# EAGLE design Qwiic-Step (EAGLE 9.5.2)
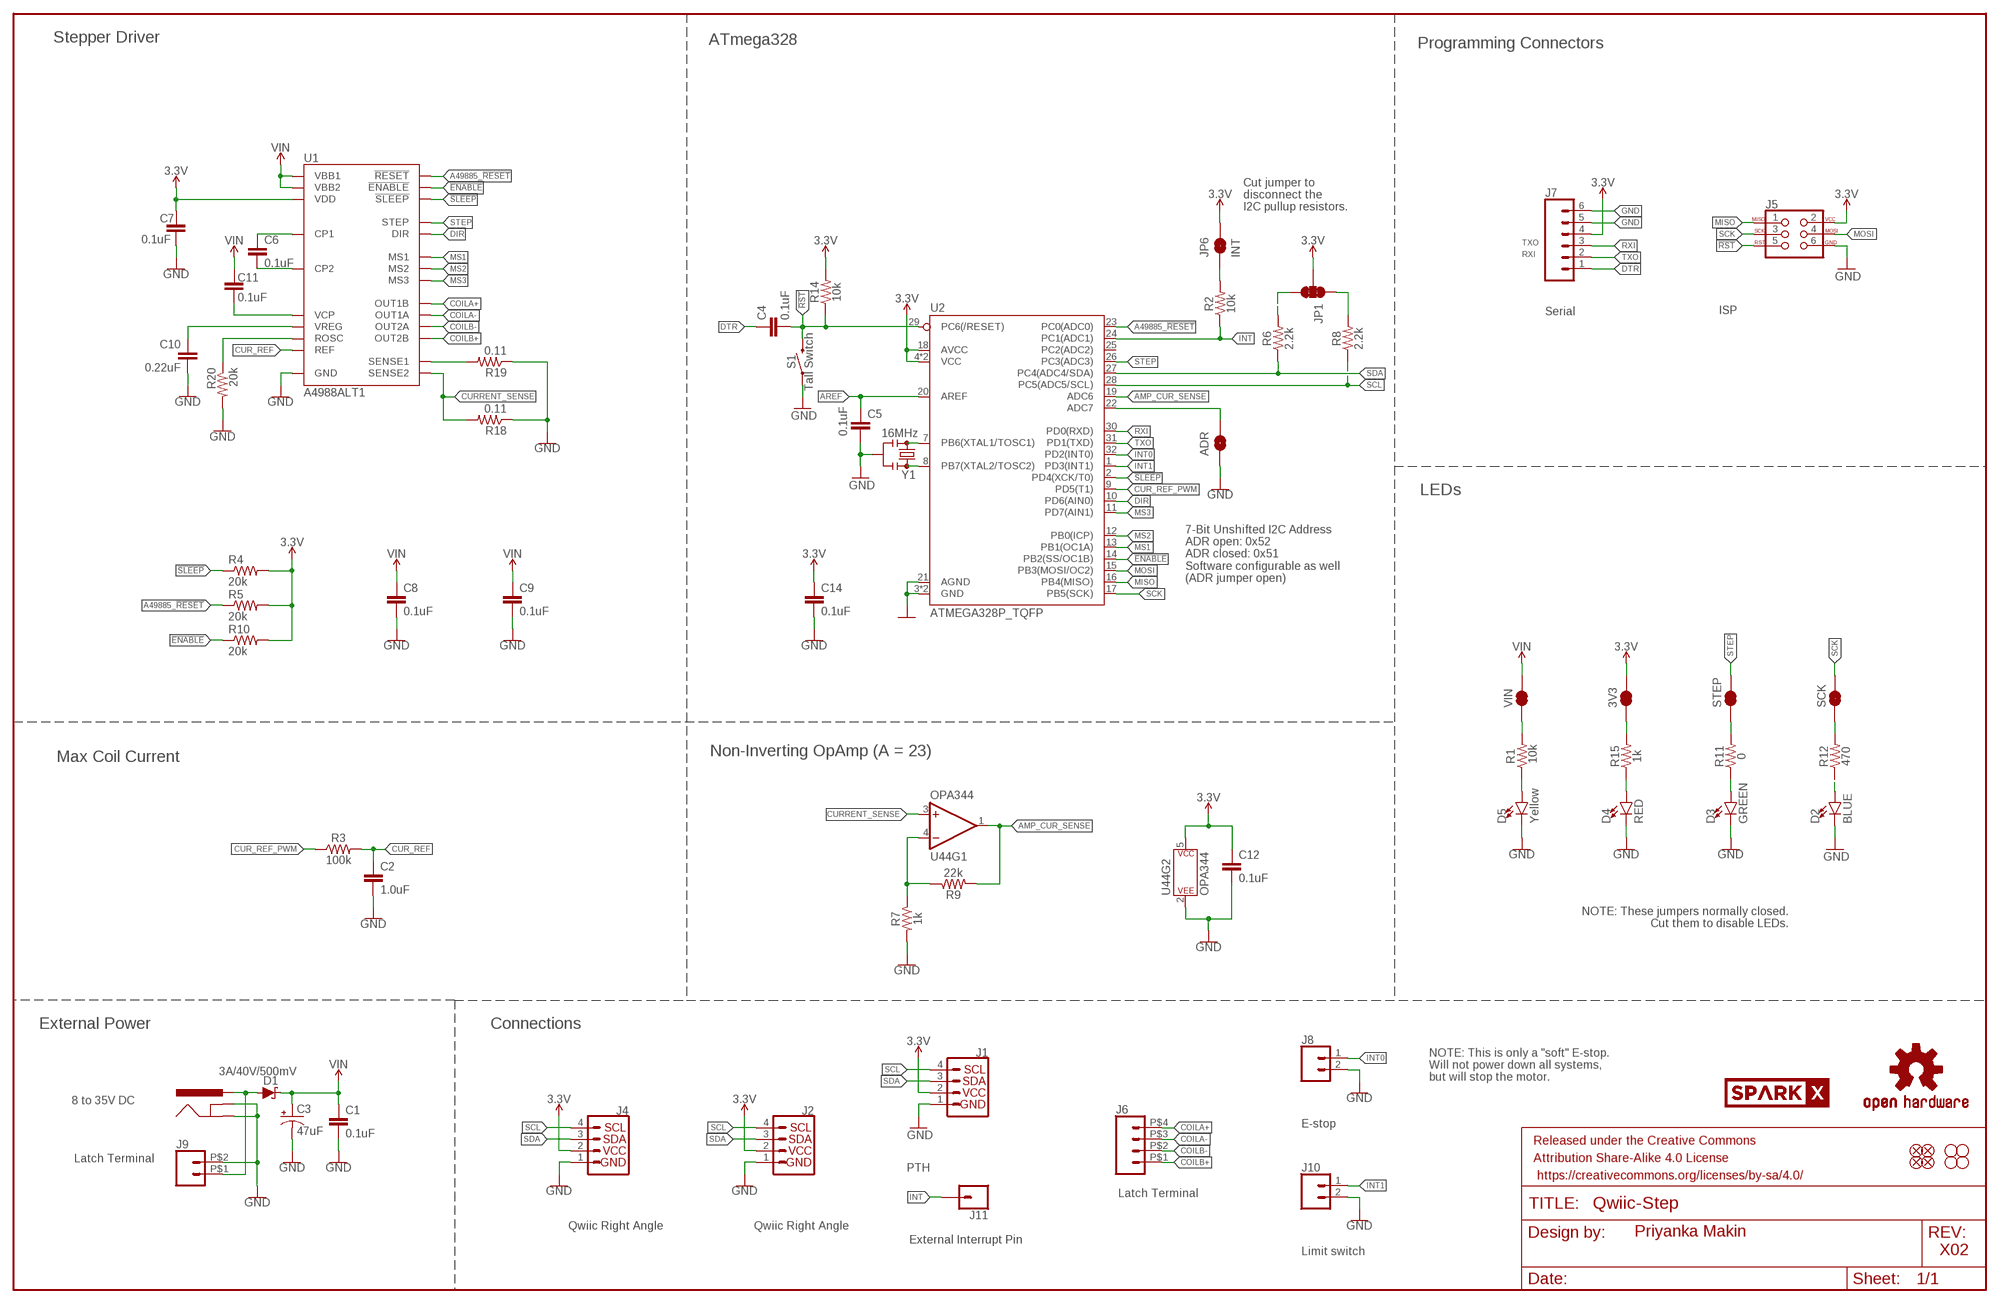
[diagram p0: schematic, sheet 1]

## Parts
3V3  JUMPER-SMT_2_NC_TRACE_SILK  [SMT-JUMPER_2_NC_TRACE_SILK]
ADR  ADR  JUMPER-SMT_2_NO_SILK  [SMT-JUMPER_2_NO_SILK]
C1  0.1uF  0.1UF-0603-100V-10%  [0603]
C2  1.0uF  1.0UF-0603-16V-10%-X7R  [0603]
C3  47uF  47UF-POLAR-PANASONIC_D-35V-20%  [PANASONIC_D]
C4  0.1uF  0.1UF-0603-100V-10%  [0603]
C5  0.1uF  0.1UF-0603-25V-(+80/-20%)  [0603]
C6  0.1uF  0.1UF-0603-100V-10%  [0603]
C7  0.1uF  0.1UF-0603-25V-(+80/-20%)  [0603]
C8  0.1uF  0.1UF-0603-100V-10%  [0603]
C9  0.1uF  0.1UF-0603-100V-10%  [0603]
C10  0.22uF  0.22UF-0603-50V-(-20/+80%)  [0603]
C11  0.1uF  0.1UF-0603-100V-10%  [0603]
C12  0.1uF  0.1UF-0603-25V-(+80/-20%)  [0603]
C14  0.1uF  0.1UF-0603-25V-(+80/-20%)  [0603]
D1  3A/40V/500mV  DIODE-SCHOTTKY-B340A  [SMA-DIODE]
D2  BLUE  LED-BLUE0603  [LED-0603]
D3  GREEN  LED-GREEN0603  [LED-0603]
D4  RED  LED-RED0603  [LED-0603]
D5  Yellow  LED-YELLOW0603  [LED-0603]
FD1  FIDUCIAL1X2  [FIDUCIAL-1X2]
FD2  FIDUCIAL1X2  [FIDUCIAL-1X2]
FD3  FIDUCIAL1X2  [FIDUCIAL-1X2]
FD4  FIDUCIAL1X2  [FIDUCIAL-1X2]
FRAME2  FRAME-LEDGER  [CREATIVE_COMMONS]
J1  PTH  I2C_STANDARD_NO_SILK  [1X04_NO_SILK]
J2  Qwiic Right Angle  I2C_STANDARDQWIIC  [JST04_1MM_RA]
J3  5.5x2.1mm Barrel  POWER_JACKSMD  [POWER_JACK_SMD]
J4  Qwiic Right Angle  I2C_STANDARDQWIIC  [JST04_1MM_RA]
J5  ISP  AVR_SPI_PROG_3X2TESTPOINTS  [2X3_TEST_POINTS]
J6  CONN_04LATCH  [LATCHTERMINAL-5MM-4]
J7  CONN_06NO_SILK_NO_POP  [1X06_NO_SILK]
J8  CONN_02-JST-2MM-SMT  [JST-2-SMD]
J9  CONN_02LATCH_2  [LATCHTERMINAL-5MM-2]
J10  CONN_02-JST-2MM-SMT  [JST-2-SMD]
J11  CONN_01PTH_NO_SILK_YES_STOP  [1X01_NO_SILK]
JP1  JUMPER-SMT_3_2-NC_TRACE_SILK  [SMT-JUMPER_3_2-NC_TRACE_SILK]
JP6  INT  JUMPER-SMT_2_NC_TRACE_SILK  [SMT-JUMPER_2_NC_TRACE_SILK]
JP7  STAND-OFF  [STAND-OFF]
JP8  STAND-OFF  [STAND-OFF]
JP9  STAND-OFF  [STAND-OFF]
JP10  STAND-OFF  [STAND-OFF]
LOGO1  OSHW-LOGOMINI  [OSHW-LOGO-MINI]
R1  10k  10KOHM-0603-1/10W-1%  [0603]
R2  10k  10KOHM-0603-1/10W-1%  [0603]
R3  100k  100KOHM-0603-1/10W-1%  [0603]
R4  20k  20KOHM-0603-1/10W-1%  [0603]
R5  20k  20KOHM-0603-1/10W-1%  [0603]
R6  2.2k  2.2KOHM-0603-1/10W-1%  [0603]
R7  1k  1KOHM-0603-1/10W-1%  [0603]
R8  2.2k  2.2KOHM-0603-1/10W-1%  [0603]
R9  22k  22KOHM-0603-1/10W-1%  [0603]
R10  20k  20KOHM-0603-1/10W-1%  [0603]
R11  0  0OHM-0603-1/10W  [0603]
R12  470  470OHM-0603-1/10W-1%  [0603]
R14  10k  10KOHM-0603-1/10W-1%  [0603]
R15  1k  1KOHM-0603-1/10W-1%  [0603]
R18  0.11  0.11OHM-2010-1/2W-1%  [2010]
R19  0.11  0.11OHM-2010-1/2W-1%  [2010]
R20  20k  20KOHM-0603-1/10W-1%  [0603]
S1  Tall Switch  MOMENTARY-SWITCH-SPST-SMD-5.2-TALL-REDUNDANT  [TACTILE_SWITCH_SMD_5.2MM]
SCK  JUMPER-SMT_2_NC_TRACE_SILK  [SMT-JUMPER_2_NC_TRACE_SILK]
STEP  JUMPER-SMT_2_NC_TRACE_SILK  [SMT-JUMPER_2_NC_TRACE_SILK]
U1  A4988ALT1  [QFN-28-5MM]
U2  ATMEGA328P_TQFP  [TQFP32-08]
U44  OPA344  [SOT23-5]
U$49  SPARKX-LOGO4  [SPARKX-MEDIUM]
VIN  JUMPER-SMT_2_NC_TRACE_SILK  [SMT-JUMPER_2_NC_TRACE_SILK]
Y1  16MHz  RESONATOR-16MHZSMD_3.2X1.3  [RESONATOR-SMD-3.2X1.3]

## Nets
3.3V: 3V3.2 C7.1 C12.1 C14.1 J1.2(VCC) J2.2 J4.2 J5.2 J7.4 JP1.2 JP6.2 R4.2 R5.2 R10.2 R14.2 U1.15(VDD) U2.4(VCC) U2.6(VCC) U2.18(AVCC) U44.5(P$V+)
!ENABLE!: R10.1 U1.2(!ENABLE!) U2.14(PB2(SS/OC1B))
!RST!: C4.2 J5.5 R14.1 S1.3 S1.4 U2.29(PC6(/RESET))
!SLEEP!: R4.1 U1.14(!SLEEP!) U2.2(PD4(XCK/T0))
A49885_!RESET!: R5.1 U1.12(!RESET!) U2.23(PC0(ADC0))
AMP_CUR_SENSE: R9.2 U2.19(ADC6) U44.1(OUT)
AREF: C5.1 U2.20(AREF)
COILA+: J6.P$4 U1.21(OUT1B)
COILA-: J6.P$3 U1.24(OUT1A)
COILB+: J6.P$1 U1.1(OUT2B)
COILB-: J6.P$2 U1.26(OUT2A)
CUR_REF: C2.1 R3.2 U1.17(REF)
CUR_REF_PWM: R3.1 U2.9(PD5(T1))
CURRENT_SENSE: R18.2 U1.27(SENSE2) U44.3(+IN)
DIR: U1.19(DIR) U2.10(PD6(AIN0))
DTR: C4.1 J7.1
GND: ADR.2 C1.2 C2.2 C3.- C5.2 C7.2 C8.2 C9.2 C10.2 C12.2 C14.2 D2.C D3.C D4.C D5.C J1.1(GND) J2.1 J3.GND(GNDBREAK) J3.P$4(GND) J4.1 J5.6 J7.5 J7.6 J8.2 J9.P$2 J10.2 R7.2 R18.1 R19.1 R20.2 S1.1 S1.2 U1.3(GND) U1.18(GND) U1.29(GND) U2.3(GND) U2.5(GND) U2.21(AGND) U44.2(P$V-) Y1.2
INT: J11.1 R2.1 U2.24(PC1(ADC1))
INT0: J8.1 U2.32(PD2(INT0))
INT1: J10.1 U2.1(PD3(INT1))
MISO: J5.1 U2.16(PB4(MISO))
MOSI: J5.4 U2.15(PB3(MOSI/OC2))
MS1: U1.9(MS1) U2.13(PB1(OC1A))
MS2: U1.10(MS2) U2.12(PB0(ICP))
MS3: U1.11(MS3) U2.11(PD7(AIN1))
N$1: D3.A R11.1
N$2: R7.1 R9.1 U44.4(-IN)
N$3: R19.2 U1.23(SENSE1)
N$4: R1.2 VIN.1
N$5: JP6.1 R2.2
N$6: ADR.1 U2.22(ADC7)
N$7: D1.A J3.VIN0(PWR) J9.P$1
N$8: C6.1 U1.4(CP1)
N$9: C6.2 U1.5(CP2)
N$10: D5.A R1.1
N$11: R11.2 STEP.1
N$12: D2.A R12.1
N$13: U2.7(PB6(XTAL1/TOSC1)) Y1.1
N$14: U2.8(PB7(XTAL2/TOSC2)) Y1.3
N$15: JP1.3 R6.2
N$16: JP1.1 R8.2
N$17: R12.2 SCK.1
N$19: R20.1 U1.13(ROSC)
N$20: C10.1 U1.8(VREG)
N$21: C11.1 U1.6(VCP)
N$26: D4.A R15.1
N$27: 3V3.1 R15.2
RXI: J7.3 U2.30(PD0(RXD))
SCK: J5.3 SCK.2 U2.17(PB5(SCK))
SCL: J1.4(SCL) J2.4 J4.4 R8.1 U2.28(PC5(ADC5/SCL))
SDA: J1.3(SDA) J2.3 J4.3 R6.1 U2.27(PC4(ADC4/SDA))
STEP: STEP.2 U1.16(STEP) U2.26(PC3(ADC3))
TXO: J7.2 U2.31(PD1(TXD))
VIN [PWR]: C1.1 C3.+ C8.1 C9.1 C11.2 D1.C U1.22(VBB1) U1.28(VBB2) VIN.2
Unconnected: U2.25(PC2(ADC2))

## Notes on the sheet
- Stepper Driver
- ATmega328 | Programming Connectors
- Cut jumper to 
  disconnect the 
  I2C pullup resistors.
- TXO
- RXI
- Serial
- LEDs
- 7-Bit Unshifted I2C Address
  ADR open: 0x52
  ADR closed: 0x51
  Software configurable as well 
  (ADR jumper open)
- Max Coil Current | Non-Inverting OpAmp (A = 23)
- NOTE: These jumpers normally closed.
  Cut them to disable LEDs.
- External Power | Connections
- NOTE: This is only a "soft" E-stop. 
  Will not power down all systems, 
  but will stop the motor.
- 8 to 35V DC
- E-stop
- Latch Terminal
- Latch Terminal
- Priyanka Makin
- External Interrupt Pin
- Limit switch | X02

## Library data of the parts
3V3 JP6 SCK STEP VIN = SparkFun-Jumpers:JUMPER-SMT_2_NC_TRACE: Normally closed trace jumper This jumper has a trace between two pads so it's normally closed (NC). Use a razor knife to open the connection. For best results follow the IPC guidelines for cutting traces: Cutout at least 0.063 mm (0.005 in). Remove all loose material to clean up the cut area. Seal the cut with an approved epoxy. Reapply solder to reclose the connection.
ADR = SparkFun-Jumpers:JUMPER-SMT_2_NO: Normally open jumper This jumper has two pads in close proximity to each other. Apply solder to close the connection. Round pads are easier to solder for beginners, but are a lot larger. SparkFun Product that uses the round pads: SparkFun EL Sequencer <https://www.sparkfun.com/products/12781>
C1 C4 C6 C8 C9 C11 = SparkFun-Capacitors:0.1UF: 0.1µF ceramic capacitors A capacitor is a passive two-terminal electrical component used to store electrical energy temporarily in an electric field.; PROD_ID: CAP-08390
C2 = SparkFun-Capacitors:1.0UF: 1µF ceramic capacitors A capacitor is a passive two-terminal electrical component used to store electrical energy temporarily in an electric field.; PROD_ID: CAP-13930
C3 = SparkFun-Capacitors:47UF-POLAR: 47µF polarized capacitors A capacitor is a passive two-terminal electrical component used to store electrical energy temporarily in an electric field.; PROD_ID: CAP-08478
C5 C7 C12 C14 = SparkFun-Capacitors:0.1UF: 0.1µF ceramic capacitors A capacitor is a passive two-terminal electrical component used to store electrical energy temporarily in an electric field.; PROD_ID: CAP-00810
C10 = SparkFun-Capacitors:0.22UF: 0.22µF ceramic capacitors A capacitor is a passive two-terminal electrical component used to store electrical energy temporarily in an electric field.; PROD_ID: CAP-09885
D1 = SparkFun-DiscreteSemi:DIODE-SCHOTTKY: Schottky diode A Schottky diode is a semiconductor diode which has a low forward voltage drop and a very fast switching action.; PROD_ID: DIO-09886
D2 = SparkFun-LED:LED-BLUE: Blue SMD LED Used in manufacturing of various products at SparkFun Packages: 0603 - SMD 0603 package [Product Link] <http://www.digikey.com/product-detail/en/SMLE12BC7TT86/511-1589-2-ND/1641808> 1206 - SMD1206 package [Product Link] <http://www.digikey.com/product-detail/en/lite-on-inc/LTST-C150TBKT/160-1643-1-ND/573584> SparkFun Products: ESP8266 Thing-Dev Board <https://www.sparkfun.com/products/13711> RedBoard <https://www.sparkfun.com/products/12757>; PROD_ID: DIO-08575
D3 = SparkFun-LED:LED-GREEN: Green SMD LED Used in manufacturing of various products at SparkFun Packages: 0603 - SMD 0603 package [Product Link] <http://www.futureelectronics.com/en/technologies/semiconductors/optoelectronics/leds/Pages/9894312-LTST-C190GKT.aspx?CrossPart=HSMG-C190&IM=0> LilyPad 1206 - SMD1206 LilyPad package [Product Link] <http://www.futureelectronics.com/en/Technologies/Product.aspx?ProductID=IN150NGHARVATEKCORPORATION2049943&IM=0> 1206 - SMD1206 package [Product Link] <http://www.futureelectronics.com/en/technologies/semiconductors/optoelectronics/leds/Pages/8315665-LTST-C150KGKT.aspx?IM=0> 1206 Bottom Mount -SMD 1206 Bottom Mount [Product Link] <http://www.digikey.com/product-detail/en/lite-on-inc/LTST-C230KGKT/160-1456-1-ND/386854> SparkFun Products: Pro Mini 328 -5V <https://www.sparkfun.com/products/821> RedBoard <https://www.sparkfun.com/products/12757> MP3 Trigger <https://www.sparkfun.com/products/13720> Makey Makey <https://www.sparkfun.com/products/11076>; PROD_ID: DIO-00821
D4 = SparkFun-LED:LED-RED: Red SMD LED Used in manufacturing of most products at SparkFun Packages: 0603 - SMD 0603 package [Product Link] <http://docs.avagotech.com/docs/AV02-0551EN> 0603 SMART - SMD 0603 SMART package ( more efficient and expensive)[Product Link] <http://www.osram-os.com/Graphics/XPic2/00077099_0.pdf> 1206 - SMD1206 package [Product Link] <https://www.sparkfun.com/datasheets/DevTools/LilyPad/Q150OVS4.pdff> SparkFun Products: Pro Mini 328 -5V <https://www.sparkfun.com/products/821> RedBoard <https://www.sparkfun.com/products/12757> IOIO-OTG <https://www.sparkfun.com/products/13613>; PROD_ID: DIO-00819
D5 = SparkFun-LED:LED-YELLOW: Yellow SMD LED Used in manufacturing several products at SparkFun. Packages: 0603 - SMD 0603 package[Product Link] <http://www.kingbrightusa.com/product.asp?catalog_name=LED&product_id=APT1608SYCK> 0603 -SMART - SMART SMD 0603 package (more efficient/more expensive) [Product Link] <http://www.osram-os.com/osram_os/en/products/product-catalog/led-light-emitting-diodes/smartled-0603/ly-l29k/index.jsp> LilyPad - SMD1206 package[Product Datasheet] <https://www.sparkfun.com/datasheets/DevTools/LilyPad/Q150YUS4.pdf> SparkFun Products: Blynk Board <https://www.sparkfun.com/products/13794> IOIO-OTG <https://www.sparkfun.com/products/13613> XBee Explorer Serial <https://www.sparkfun.com/products/13225>; PROD_ID: DIO-09003
FD1-FD4 = SparkFun-Aesthetics:FIDUCIAL: Fiducial Alignment Points Point-of-reference for pick-and-place machines and other optical instruments.
FRAME2 = SparkFun-Aesthetics:FRAME-LEDGER: Schematic Frame - Ledger Standard 11x14 US Ledger frame
J1 = SparkX:I2C_STANDARD: SparkFun I2C Standard Pinout Header SparkFun has standardized on a pinout for all I2C based sensor breakouts. This pinout allows I2C boards to be plugged directly into the headers on Arduino Uno compatible boards, and to be daisy chained easily. Example SparkFun Products: SparkFun Atmospheric Sensor Breakout - BME280 <https://www.sparkfun.com/products/13676> SparkFun Altitude/Pressure Sensor Breakout - MPL3115A2 <https://www.sparkfun.com/products/11084> SparkFun TOF Range Finder Sensor - VL6180 <https://www.sparkfun.com/products/12785>
J2 J4 = SparkFun-Connectors:I2C_STANDARD: SparkFun I2C Standard Pinout Header SparkFun has standardized on a pinout for all I2C based sensor breakouts. This pinout allows I2C boards to be plugged directly into the headers on Arduino Uno compatible boards, and to be daisy chained easily. Example SparkFun Products: SparkFun Atmospheric Sensor Breakout - BME280 <https://www.sparkfun.com/products/13676> SparkFun Altitude/Pressure Sensor Breakout - MPL3115A2 <https://www.sparkfun.com/products/11084> SparkFun TOF Range Finder Sensor - VL6180 <https://www.sparkfun.com/products/12785>; PROD_ID: CONN-13694
J3 = SparkFun-Connectors:POWER_JACK: Power Jack Connector This is the standard 5.5mm barrel jack for power. The PTH is the most common, proven, reliable, footprint. The Slot footprint only works if the mill layer is transmitted to the PCB fab house so be warned. Here are the connectors we sell at SparkFun: DC Barrel Power Jack/Connector <https://www.sparkfun.com/products/119> (PRT-00119) DC Barrel Power Jack/Connector (SMD) <https://www.sparkfun.com/products/12748> (PRT-12748) DC Barrel Jack Adapter - Breadboard Compatible <https://www.sparkfun.com/products/10811> (PRT-10811) It is used on this SparkFun product (and many, many others): SparkFun RedBoard - Programmed with Arduino <https://www.sparkfun.com/products/12757> (DEV-12757) Also, if you need a mating power supply or connector, please check these out: Wall Adapter Power Supply - 9VDC 650mA <https://www.sparkfun.com/products/298> (TOL-00298) DC Barrel Jack Adapter - Male <https://www.sparkfun.com/products/10287> (PRT-10287); PROD_ID: CONN-08106; SF_ID: PRT-12748
J5 = SparkFun-Connectors:AVR_SPI_PROG_3X2: AVR ISP 6 Pin This is the reduced ISP connector for AVR programming. Common on Arduino. This footprint will take up less PCB space and can be used with a 10-pin to 6-pin adapter such as SKU: BOB-08508 **Special note about "TEST_POINT" package. The stop mask is on the top side, so if you want your programming test points to be on the bottom of your board, make sure to place this package on the bottom side of the board. This also ensure that the orientation to program from the bottom side will be correct. SparkFun Products: SparkFun ISP Pogo Adapter <https://www.sparkfun.com/products/11591> - NS Tiny AVR Programmer <https://www.sparkfun.com/products/11801> -PTH
J6 = SparkFun-Connectors:CONN_04: Multi connection point. Often used as Generic Header-pin footprint for 0.1 inch spaced/style header connections On any of the 0.1 inch spaced packages, you can populate with these: Break Away Headers - Straight <https://www.sparkfun.com/products/116> (PRT-00116) Break Away Male Headers - Right Angle <https://www.sparkfun.com/products/553> (PRT-00553) Female Headers <https://www.sparkfun.com/products/115> (PRT-00115) Break Away Headers - Machine Pin <https://www.sparkfun.com/products/117> (PRT-00117) Break Away Female Headers - Swiss Machine Pin <https://www.sparkfun.com/products/743> (PRT-00743) For SCREWTERMINALS and SPRING TERMINALS visit here: Screw Terimnals on SparkFun.com <https://www.sparkfun.com/search/results?term=Screw+Terminals> (5mm/3.5mm/2.54mm spacing) This device is also useful as a general connection point to wire up your design to another part of your project. Our various solder wires solder well into these plated through hole pads. Hook-Up Wire - Assortment (Stranded, 22 AWG) <https://www.sparkfun.com/products/11375> (PRT-11375) Hook-Up Wire - Assortment (Solid Core, 22 AWG) <https://www.sparkfun.com/products/11367> (PRT-11367) View the entire wire category on our website here <https://www.sparkfun.com/categories/141> Special notes: Molex polarized connector foot print use with SKU : PRT-08231 with associated crimp pins and housings. 1MM SMD Version SKU: PRT-10208
J7 = SparkFun-Connectors:CONN_06: Multi connection point. Often used as Generic Header-pin footprint for 0.1 inch spaced/style header connections On any of the 0.1 inch spaced packages, you can populate with these: Break Away Headers - Straight <https://www.sparkfun.com/products/116> (PRT-00116) Break Away Male Headers - Right Angle <https://www.sparkfun.com/products/553> (PRT-00553) Female Headers <https://www.sparkfun.com/products/115> (PRT-00115) Break Away Headers - Machine Pin <https://www.sparkfun.com/products/117> (PRT-00117) Break Away Female Headers - Swiss Machine Pin <https://www.sparkfun.com/products/743> (PRT-00743) Arduino Stackable Header - 6 Pin <https://www.sparkfun.com/products/9280> (PRT-09280) For SCREWTERMINALS and SPRING TERMINALS visit here: Screw Terimnals on SparkFun.com <https://www.sparkfun.com/search/results?term=Screw+Terminals> (5mm/3.5mm/2.54mm spacing) This device is also useful as a general connection point to wire up your design to another part of your project. Our various solder wires solder well into these plated through hole pads. Hook-Up Wire - Assortment (Stranded, 22 AWG) <https://www.sparkfun.com/products/11375> (PRT-11375) Hook-Up Wire - Assortment (Solid Core, 22 AWG) <https://www.sparkfun.com/products/11367> (PRT-11367) View the entire wire category on our website here <https://www.sparkfun.com/categories/141>
J8 J10 = SparkFun-Connectors:CONN_02: Multi connection point. Often used as Generic Header-pin footprint for 0.1 inch spaced/style header connections On any of the 0.1 inch spaced packages, you can populate with these: Break Away Headers - Straight <https://www.sparkfun.com/products/116> (PRT-00116) Break Away Male Headers - Right Angle <https://www.sparkfun.com/products/553> (PRT-00553) Female Headers <https://www.sparkfun.com/products/115> (PRT-00115) Break Away Headers - Machine Pin <https://www.sparkfun.com/products/117> (PRT-00117) Break Away Female Headers - Swiss Machine Pin <https://www.sparkfun.com/products/743> (PRT-00743) For SCREWTERMINALS and SPRING TERMINALS visit here: Screw Terimnals on SparkFun.com <https://www.sparkfun.com/search/results?term=Screw+Terminals> (5mm/3.5mm/2.54mm spacing) This device is also useful as a general connection point to wire up your design to another part of your project. Our various solder wires solder well into these plated through hole pads. Hook-Up Wire - Assortment (Stranded, 22 AWG) <https://www.sparkfun.com/products/11375> (PRT-11375) Hook-Up Wire - Assortment (Solid Core, 22 AWG) <https://www.sparkfun.com/products/11367> (PRT-11367) View the entire wire category on our website here <https://www.sparkfun.com/categories/141> Special notes: Molex polarized connector foot print use with: PRT-08233 with associated crimp pins and housings. 2.54_SCREWTERM for use with PRT-10571. 3.5mm Screw Terminal footprints for PRT-08084 5mm Screw Terminal footprints for use with PRT-08432; PROD_ID: CONN-11443
J9 = SparkFun-Connectors:CONN_02: Multi connection point. Often used as Generic Header-pin footprint for 0.1 inch spaced/style header connections On any of the 0.1 inch spaced packages, you can populate with these: Break Away Headers - Straight <https://www.sparkfun.com/products/116> (PRT-00116) Break Away Male Headers - Right Angle <https://www.sparkfun.com/products/553> (PRT-00553) Female Headers <https://www.sparkfun.com/products/115> (PRT-00115) Break Away Headers - Machine Pin <https://www.sparkfun.com/products/117> (PRT-00117) Break Away Female Headers - Swiss Machine Pin <https://www.sparkfun.com/products/743> (PRT-00743) For SCREWTERMINALS and SPRING TERMINALS visit here: Screw Terimnals on SparkFun.com <https://www.sparkfun.com/search/results?term=Screw+Terminals> (5mm/3.5mm/2.54mm spacing) This device is also useful as a general connection point to wire up your design to another part of your project. Our various solder wires solder well into these plated through hole pads. Hook-Up Wire - Assortment (Stranded, 22 AWG) <https://www.sparkfun.com/products/11375> (PRT-11375) Hook-Up Wire - Assortment (Solid Core, 22 AWG) <https://www.sparkfun.com/products/11367> (PRT-11367) View the entire wire category on our website here <https://www.sparkfun.com/categories/141> Special notes: Molex polarized connector foot print use with: PRT-08233 with associated crimp pins and housings. 2.54_SCREWTERM for use with PRT-10571. 3.5mm Screw Terminal footprints for PRT-08084 5mm Screw Terminal footprints for use with PRT-08432
J11 = SparkFun-Connectors:CONN_01: Single connection point. Often used as Generic Header-pin footprint for 0.1 inch spaced/style header connections On any of the 0.1 inch spaced packages, you can populate with these: Break Away Headers - Straight <https://www.sparkfun.com/products/116> (PRT-00116) Break Away Male Headers - Right Angle <https://www.sparkfun.com/products/553> (PRT-00553) Female Headers <https://www.sparkfun.com/products/115> (PRT-00115) Break Away Headers - Machine Pin <https://www.sparkfun.com/products/117> (PRT-00117) Break Away Female Headers - Swiss Machine Pin <https://www.sparkfun.com/products/743> (PRT-00743) This device is also useful as a general connection point to wire up your design to another part of your project. Our various solder wires solder well into these plated through hole pads. Hook-Up Wire - Assortment (Stranded, 22 AWG) <https://www.sparkfun.com/products/11375> (PRT-11375) Hook-Up Wire - Assortment (Solid Core, 22 AWG) <https://www.sparkfun.com/products/11367> (PRT-11367) View the entire wire category on our website here <https://www.sparkfun.com/categories/141> Special notes: SMTSO-256-ET is a "flush mount" nut for a 4-40 screw. We mostly use this on specialty testbeds; it is a nice way to connect hardware to your PCB at an adjustable hieght. Also note, the SNAP packages are for using a snappable style connector. We sell a baggie of snaps and they are also used on two LilyPad designs: Snap Assortment - 30 pack (male and female) <https://www.sparkfun.com/products/11347> (DEV-11347) LilyPad Arduino SimpleSnap <https://www.sparkfun.com/products/10941> (DEV-10941) LilyPad SimpleSnap Protoboard <https://www.sparkfun.com/products/10940> (DEV-10940)
JP1 = SparkFun-Jumpers:JUMPER-SMT_3_2-NC_TRACE: Normally closed trace jumper (2 of 2 connections) This jumper has a trace between all three pads so they are normally closed (NC). Use a razor knife to open the connection(s). For best results follow the IPC guidelines for cutting traces: Cutout at least 0.063 mm (0.005 in). Remove all loose material to clean up the cut area. Seal the cut with an approved epoxy. Reapply solder to reclose the connection(s).
JP7-JP10 = SparkFun-Hardware:STAND-OFF: Stand Off Drill holes for mechanically mounting via screws, standoffs, etc. Note: Use the keepout ring to avoid running the screw head into surrounding components. Variant Overviews STAND-OFF - Mechanical footprint for a #4 phillips button head screw. STAND-OFF-TIGHT - Mechanical footprint for a #4 phillips button head screw, Example SparkFun Products Screw - Phillips Head (1/4", 4-40, 10 pack) <https://www.sparkfun.com/products/10453> (PRT-10453) Screw - Phillips Head (1/2", 4-40, 10 pack) <https://www.sparkfun.com/products/10452> (PRT-10452) Screw - Phillips Head (3/4", 4-40, 10 pack) <https://www.sparkfun.com/products/10451> (PRT-10451) Screw - Phillips Head (1", 4-40, 10 pack) <https://www.sparkfun.com/products/10450> (PRT-10450)
LOGO1 = SparkFun-Aesthetics:OSHW-LOGO: Open-Source Hardware (OSHW) Logo This logo indicates the piece of hardware it is found on incorporates a OSHW license and/or adheres to the definition of open source hardware found here: http://freedomdefined.org/OSHW
R1 R2 R14 = SparkFun-Resistors:10KOHM: 10kΩ resistor A resistor is a passive two-terminal electrical component that implements electrical resistance as a circuit element. Resistors act to reduce current flow, and, at the same time, act to lower voltage levels within circuits. - Wikipedia; PROD_ID: RES-00824
R3 = SparkFun-Resistors:100KOHM: 100kΩ resistor A resistor is a passive two-terminal electrical component that implements electrical resistance as a circuit element. Resistors act to reduce current flow, and, at the same time, act to lower voltage levels within circuits. - Wikipedia; PROD_ID: RES-07828
R4 R5 R10 R20 = SparkFun-Resistors:20KOHM: 20kΩ resistor A resistor is a passive two-terminal electrical component that implements electrical resistance as a circuit element. Resistors act to reduce current flow, and, at the same time, act to lower voltage levels within circuits. - Wikipedia; PROD_ID: RES-09383
R6 R8 = SparkFun-Resistors:2.2KOHM: 2.2kΩ resistor A resistor is a passive two-terminal electrical component that implements electrical resistance as a circuit element. Resistors act to reduce current flow, and, at the same time, act to lower voltage levels within circuits. - Wikipedia; PROD_ID: RES-08272
R7 R15 = SparkFun-Resistors:1KOHM: 1kΩ resistor A resistor is a passive two-terminal electrical component that implements electrical resistance as a circuit element. Resistors act to reduce current flow, and, at the same time, act to lower voltage levels within circuits. - Wikipedia; PROD_ID: RES-07856
R9 = SparkFun-Resistors:22KOHM: 22kΩ resistor A resistor is a passive two-terminal electrical component that implements electrical resistance as a circuit element. Resistors act to reduce current flow, and, at the same time, act to lower voltage levels within circuits. - Wikipedia; PROD_ID: RES-07853
R11 = SparkFun-Resistors:0OHM: 0Ω resistor A resistor is a passive two-terminal electrical component that implements electrical resistance as a circuit element. Resistors act to reduce current flow, and, at the same time, act to lower voltage levels within circuits. - Wikipedia; PROD_ID: RES-08609
R12 = SparkFun-Resistors:470OHM: 470Ω resistor A resistor is a passive two-terminal electrical component that implements electrical resistance as a circuit element. Resistors act to reduce current flow, and, at the same time, act to lower voltage levels within circuits. - Wikipedia; PROD_ID: RES-07869
R18 R19 = SparkFun-Resistors:0.11OHM: 0.11Ω resistor A resistor is a passive two-terminal electrical component that implements electrical resistance as a circuit element. Resistors act to reduce current flow, and, at the same time, act to lower voltage levels within circuits. - Wikipedia; PROD_ID: RES-08354
S1 = SparkFun-Switches:MOMENTARY-SWITCH-SPST: Momentary Switch (Pushbutton) - SPST Normally-open (NO) SPST momentary switches (buttons, pushbuttons). Variants PTH-12MM - 12mm square, through-hole Momentary Pushbutton Switch - 12mm Square <https://www.sparkfun.com/products/9190> (COM-09190) PTH-6.0MM, PTH-6.0MM-KIT - 6.0mm square, through-hole Mini Pushbutton Switch <https://www.sparkfun.com/products/97> (COM-00097) KIT package intended for soldering kit's - only one side of pads' copper is exposed. PTH-RIGHT-ANGLE-KIT - Right-angle, through-hole Right Angle Tactile Button <https://www.sparkfun.com/products/10791> - Used on SparkFun BigTime Watch Kit <https://www.sparkfun.com/products/11734> SMD-12MM - 12mm square, surface-mount Tactile Button - SMD (12mm) <https://www.sparkfun.com/products/12993> (COM-12993) Used on SparkFun PicoBoard <https://www.sparkfun.com/products/11888> SMD-4.5MM - 4.5mm Square Trackball Switch Used on SparkFun Blackberry Trackballer Breakout <https://www.sparkfun.com/products/13169> SMD-4.6MMX2.8MM - 4.60mm x 2.80mm, surface mount Used on SparkFun SAMD21 Mini Breakout <https://www.sparkfun.com/products/13664> SMD-5.2MM, SMD-5.2-REDUNDANT - 5.2mm square, surface-mount Mini Pushbutton Switch - SMD <https://www.sparkfun.com/products/8720> (COM-08720) Used on Arduino Pro Mini <https://www.sparkfun.com/products/11114> REDUNDANT package connects both switch circuits together SMD-6.0X3.5MM - 6.0 x 3.5mm, surface mount Momentary Reset Switch SMD <https://www.sparkfun.com/products/8229> (COM-08229) SMD-6.2MM-TALL - 6.2mm square, surface mount Tactile Button - SMD (6mm) <https://www.sparkfun.com/products/12992> Used on SparkFun Digital Sandbox <https://www.sparkfun.com/products/12651> SMD-RIGHT-ANGLE - Right-angle, surface mount Used on SparkFun Block for Intel® Edison - Arduino <https://www.sparkfun.com/products/13036>; PROD_ID: SWCH-14139
U1 = SparkFun-IC-Special-Function:A4988: DMOS Microstepping Driver with Translator(IC-11483); PROD_ID: IC-11483
U2 = SparkFun-IC-Microcontroller:ATMEGA328P_TQFP: Popular 328P in QFP Storefront component: ATmega328 - TQFP <https://www.sparkfun.com/products/13448> (COM-13448) Datasheet <http://www.sparkfun.com/datasheets/Components/SMD/ATMega328.pdf> SparkFun Products SparkFun RedBoard - Programmed with Arduino <https://www.sparkfun.com/products/12757> (DEV-12757) Arduino Pro Mini 328 - 5V/16MHz <https://www.sparkfun.com/products/11113> (DEV-11113) Arduino Pro Mini 328 - 3.3V/8MHz <https://www.sparkfun.com/products/11114> (DEV-11114) SparkFun OpenLog <https://www.sparkfun.com/products/13712> (DEV-13712) SparkFun MicroView - OLED Arduino Module <https://www.sparkfun.com/products/12923> (DEV-12923) SparkFun Digital Sandbox <https://www.sparkfun.com/products/12651> (DEV-12651) SparkFun PicoBoard <https://www.sparkfun.com/products/11888> (WIG-11888) Arduino Fio <https://www.sparkfun.com/products/10116> (DEV-10116) LilyPad Arduino 328 Main Board <https://www.sparkfun.com/products/13342> (DEV-13342) SparkFun RedStick <https://www.sparkfun.com/products/13741> (DEV-13741) LilyPad MP3 <https://www.sparkfun.com/products/11013> (DEV-11013) LilyPad Arduino SimpleSnap <https://www.sparkfun.com/products/10941> (DEV-10941) SparkFun Stepoko <https://www.sparkfun.com/products/13899> (ROB-13899) SparkFun Geiger Counter <https://www.sparkfun.com/products/11345> (SEN-11345) SparkFun EL Sequencer <https://www.sparkfun.com/products/12781> (COM-12781) Arduino Pro 328 - 5V/16MHz <https://www.sparkfun.com/products/10915> (DEV-10915) CryptoCape <https://www.sparkfun.com/products/12773> (DEV-12773) SparkFun IR Thermometer Evaluation Board - MLX90614 <https://www.sparkfun.com/products/10740> (SEN-10740) SparkFun RedBot Mainboard <https://www.sparkfun.com/products/12097> (ROB-12097) Arduino Pro 328 - 3.3V/8MHz <https://www.sparkfun.com/products/10914> (DEV-10914) SparkFun Block for Intel® Edison - Arduino <https://www.sparkfun.com/products/13036> (DEV-13036) SparkFun Simon Says - Surface Mount Soldering Kit <https://www.sparkfun.com/products/10935> (KIT-10935) SparkFun 7-Segment Serial Display - Red <https://www.sparkfun.com/products/11441> (COM-11441) SparkFun 7-Segment Serial Display - White <https://www.sparkfun.com/products/11629> (COM-11629) SparkFun 7-Segment Serial Display - Yellow <https://www.sparkfun.com/products/11443> (COM-11443) SparkFun 7-Segment Serial Display - Kelly Green <https://www.sparkfun.com/products/11440> (COM-11440) SparkFun 7-Segment Serial Display - Blue <https://www.sparkfun.com/products/11442> (COM-11442) SparkFun OpenSegment Serial Display - 20mm (Blue) <https://www.sparkfun.com/products/11647> (COM-11647) SparkFun OpenSegment Serial Display - 20mm (Green) <https://www.sparkfun.com/products/11646> (COM-11646) SparkFun OpenSegment Serial Display - 20mm (White) <https://www.sparkfun.com/products/11648> (COM-11648) SparkFun OpenSegment Serial Display - 20mm (Red) <https://www.sparkfun.com/products/11644> (COM-11644) SparkFun OpenSegment Serial Display - 20mm (Yellow) <https://www.sparkfun.com/products/11645> (COM-11645) SparkFun OpenSegment Shield <https://www.sparkfun.com/products/13190> (DEV-13190); PROD_ID: IC-09069
U44 = SparkFun-IC-Amplifiers:OPA344: Single gate rail-to-rail output op-amp. Inputs extend 300mV past rails. Datasheet <http://www.ti.com/product/OPA344> SparkFun Products SparkFun Low Current Sensor <https://www.sparkfun.com/products/8883> (SEN-08883) SparkFun Electret Microphone Breakout <https://www.sparkfun.com/products/12758> (BOB-12758); PROD_ID: IC-08251
U$49 = SparkX:SPARKX-LOGO
Y1 = SparkFun-Clocks:RESONATOR-16MHZ: 16MHz Resonator Digikey Example <http://www.digikey.com/product-detail/en/murata-electronics-north-america/CSTCE16M0V53-R0/490-1198-1-ND/584635> Frequency: 16MHz Frequency Stability: ±0.3% Frequency Tolerance: ±0.5% Capacitance: 15pF SparkFun Products SparkFun OpenLog <https://www.sparkfun.com/products/13712> SparkFun MicroView - OLED Arduino Module <https://www.sparkfun.com/products/12923>; PROD_ID: XTAL-08900

## Net classes
1 3.3V: width 0.305 mm
2 PWR: width 0.203 mm

## Board
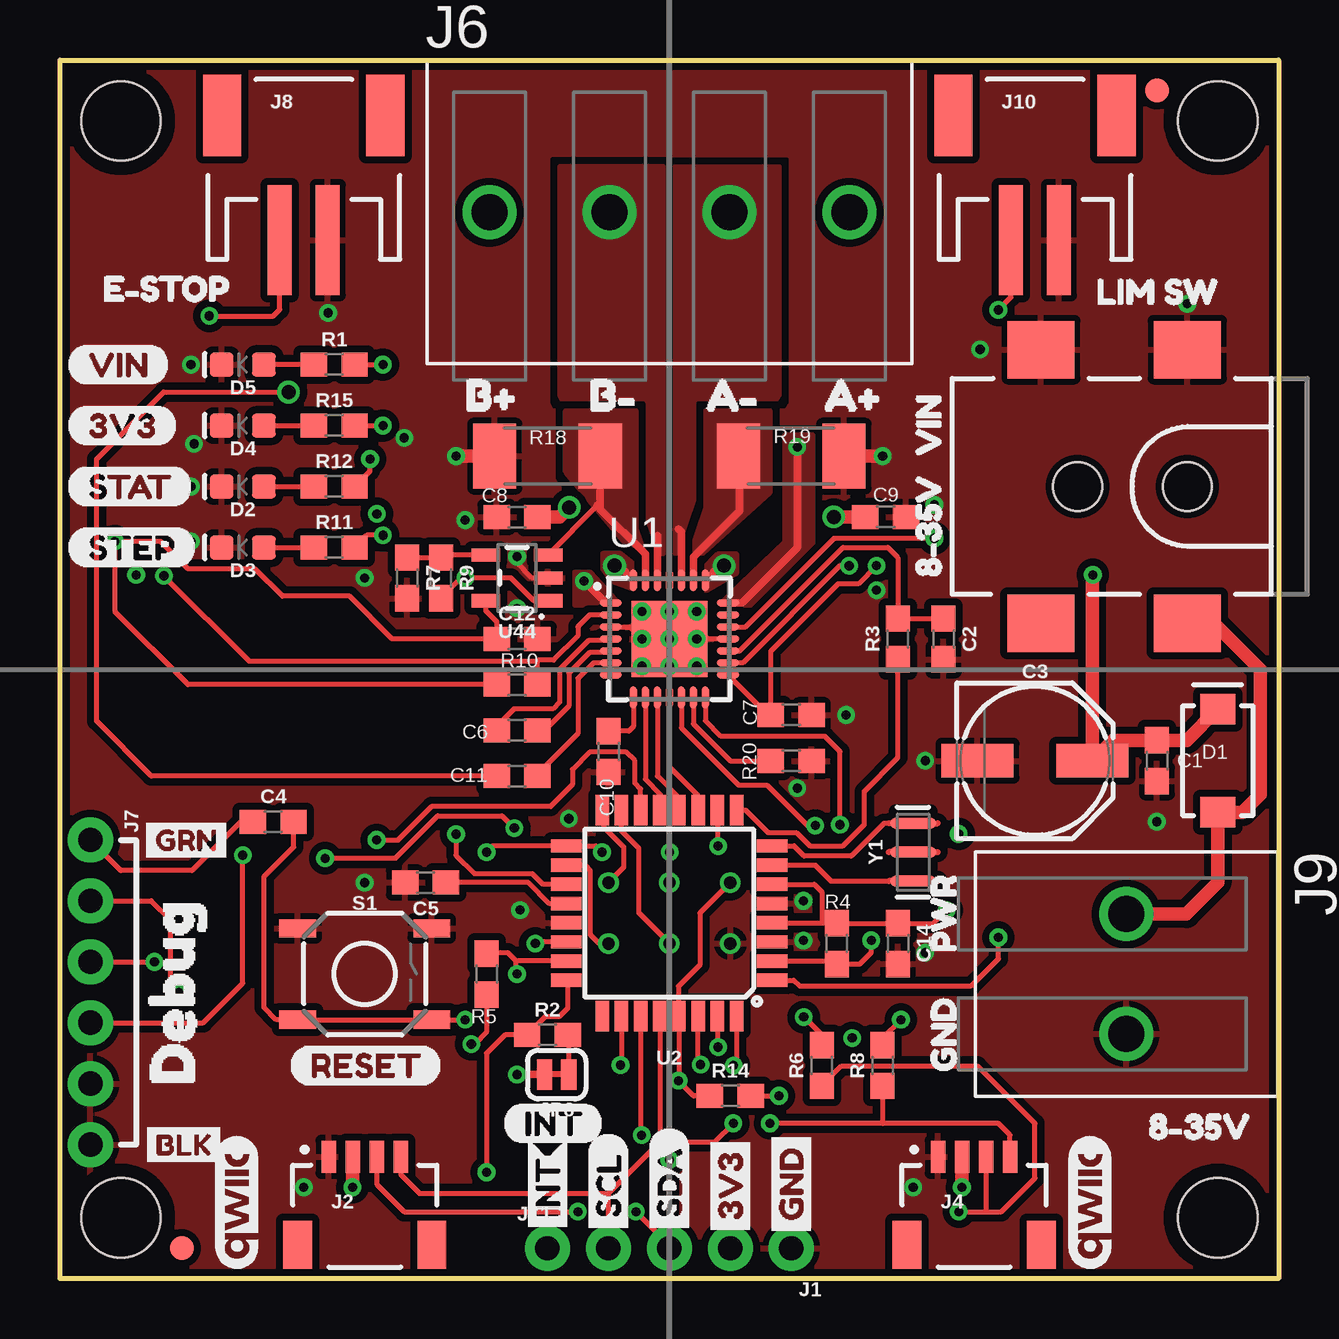
[diagram p1: board, top side]
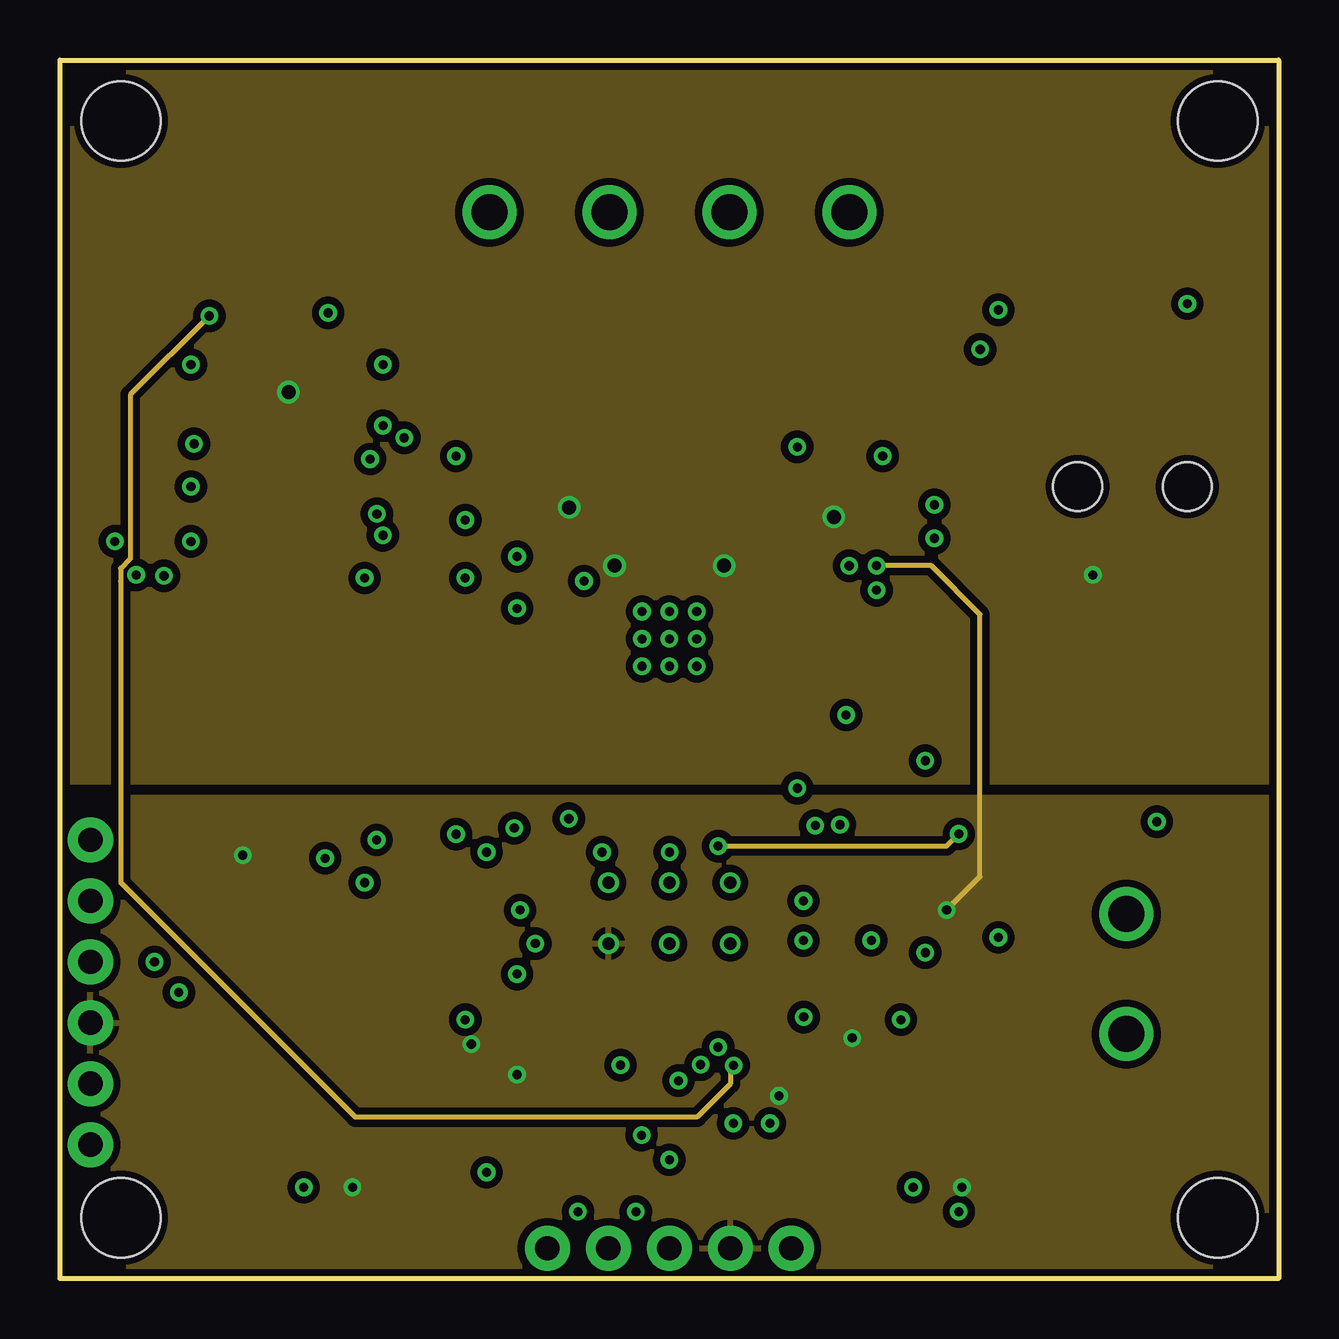
[diagram p2: board, inner layer VCC]
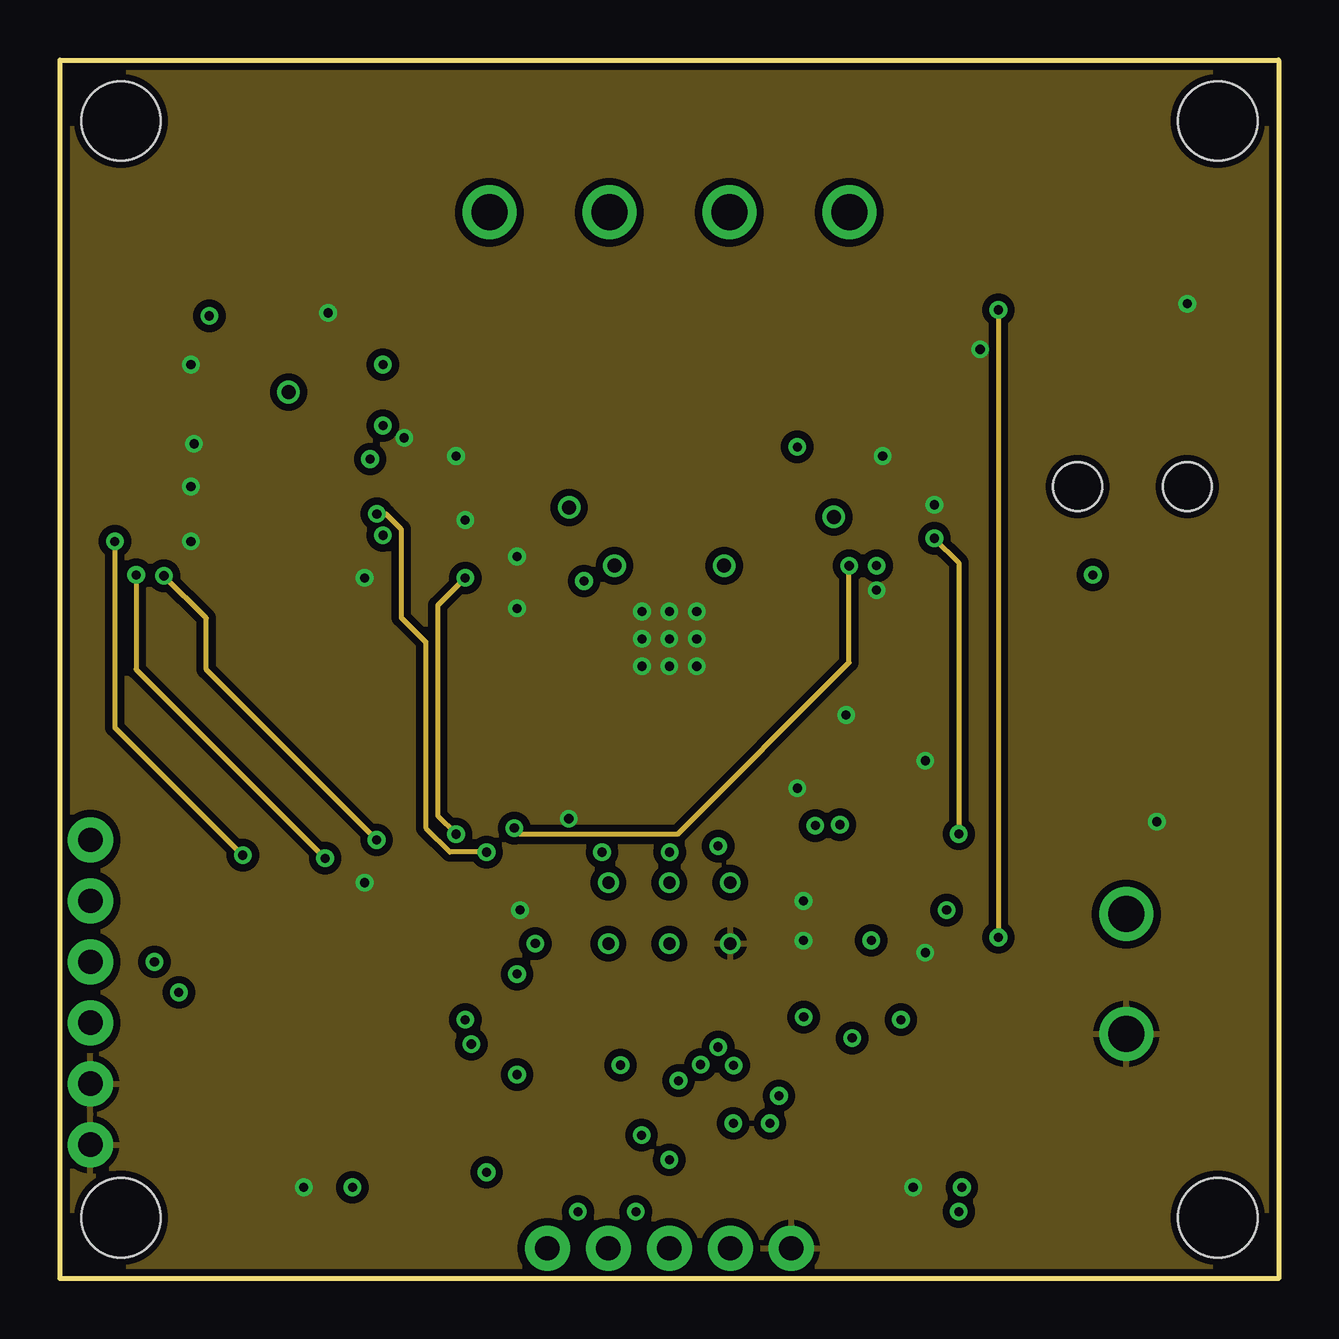
[diagram p3: board, inner layer GND]
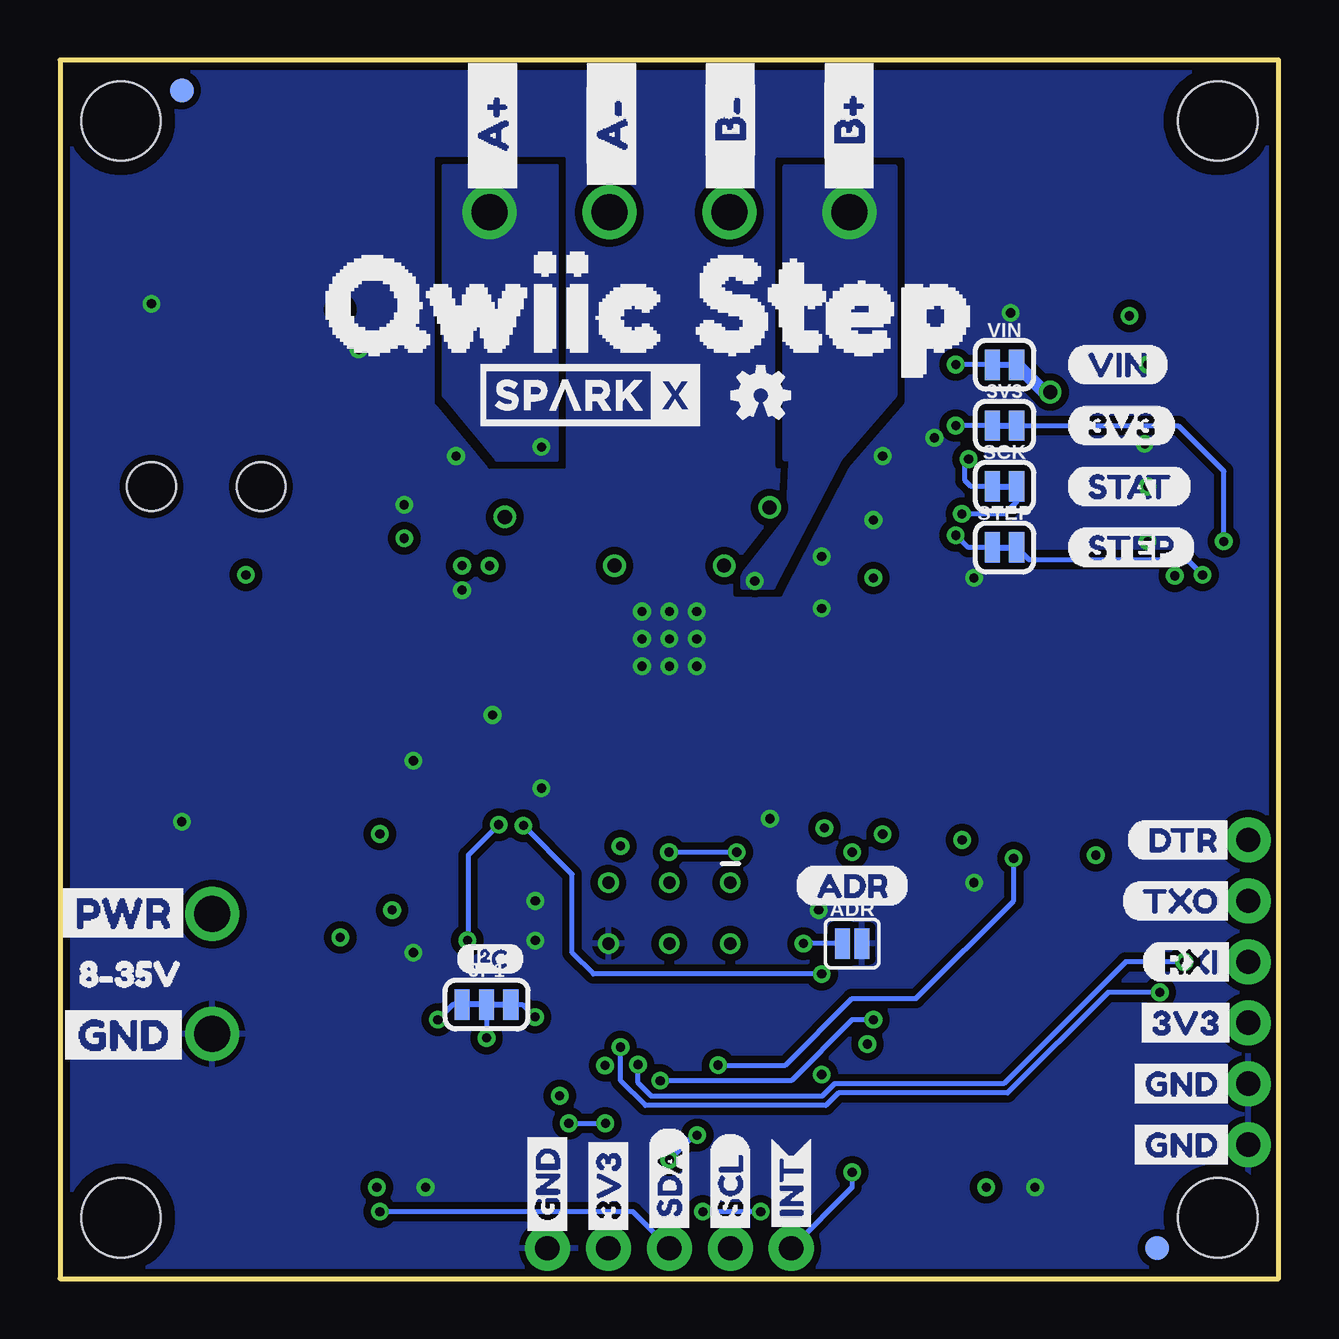
[diagram p4: board, bottom side, seen from below]

Size 50.8 x 50.8 mm. Coordinates in mm from the lower left corner, seen from the top.
Outline: 0,50.8 50.8,50.8 50.8,0 0,0 0,50.8
Copper layers (1*2*15*16): Top 0.035mm / dielectric 1.5mm / VCC 0.035mm / dielectric 0.15mm / GND 0.035mm / dielectric 0.2mm / Bottom 0.035mm
Design rules "SparkFun-2-layer-TIGHT *": minimum track width 7mil, minimum drill 15mil, track to track 7mil, track to pad 7mil, pad to pad 7mil, via to via 7mil, smd to smd 7mil, copper to edge 7mil, drill to drill 7mil, minimum pad ring 7mil, minimum via ring 7mil, stop-mask expansion 4mil, vias tented up to drill 25mil, thermal gap 10mil

### Footprints (pad centres in the part's own frame; a part is rotated, then mirrored left to right if it is on the bottom)
SMT-JUMPER_2_NC_TRACE_SILK = smd 0.635 x 1.27: 1 -0.508,0; 2 0.508,0
SMT-JUMPER_2_NO_SILK = smd 0.635 x 1.27: 1 -0.406,0; 2 0.406,0
0603 = smd 1.1 x 1: 1 -0.85,0; 2 0.85,0
PANASONIC_D = smd 3 x 1.4: + 2.4,0; - -2.4,0
SMA-DIODE = smd 1.27 x 1.47: A -2.15,0; C 2.15,0
LED-0603 = smd 1 x 1: A -0.877,0; C 0.877,0
FIDUCIAL-1X2 = smd 1 x 1: 1 0,0
1X04_NO_SILK = drill 1.016 pad 1.88: 1 0,0; 2 2.54,0; 3 5.08,0; 4 7.62,0
JST04_1MM_RA = smd 0.6 x 1.35: 1 -1.5,0; 2 -0.5,0; 3 0.5,0; 4 1.5,0 | smd 1.2 x 2: NC1 2.8,-3.675; NC2 -2.8,-3.675
POWER_JACK_SMD = smd 2.8 x 2.4: GND 0,-5.7; P$4 6.1,-5.7; VIN0 0,5.7; VIN1 6.1,5.7 | hole 2.032: 0,0; 4.572,0
2X3_TEST_POINTS = drill 0.508: 1 -2.54,-1.27; 2 -2.54,1.27; 3 0,-1.27; 4 0,1.27; 5 2.54,-1.27; 6 2.54,1.27
LATCHTERMINAL-5MM-4 = drill 1.5: P$1 -7.5,0; P$2 -2.5,0; P$3 2.5,0; P$4 7.5,0
1X06_NO_SILK = drill 1.016 pad 1.88: 1 0,0; 2 2.54,0; 3 5.08,0; 4 7.62,0; 5 10.16,0; 6 12.7,0
JST-2-SMD = smd 1 x 4.6: 1 -1,-3.7; 2 1,-3.7 | smd 1.6 x 3.4: NC1 -3.4,1.5; NC2 3.4,1.5
LATCHTERMINAL-5MM-2 = drill 1.5: P$1 -2.5,0; P$2 2.5,0
1X01_NO_SILK = drill 1.016 pad 1.88: 1 0,0
SMT-JUMPER_3_2-NC_TRACE_SILK = smd 0.635 x 1.27: 1 -1.016,0; 2 0,0; 3 1.016,0
STAND-OFF = hole 3.302: 0,0
2010 = smd 1.8 x 2.7: 1 -2.2,0; 2 2.2,0
TACTILE_SWITCH_SMD_5.2MM = smd 1.524 x 0.762: 1 -2.794,1.905; 2 2.794,1.905; 3 -2.794,-1.905; 4 2.794,-1.905
QFN-28-5MM = smd 0.94 x 0.3: 1 -2.44,1.5; 2 -2.44,1; 3 -2.44,0.5; 4 -2.44,0; 5 -2.44,-0.5; 6 -2.44,-1; 7 -2.44,-1.5; 15 2.44,-1.5; 16 2.44,-1; 17 2.44,-0.5; 18 2.44,0; 19 2.44,0.5; 20 2.44,1; 21 2.44,1.5 | smd 0.3 x 0.94: 8 -1.5,-2.44; 9 -1,-2.44; 10 -0.5,-2.44; 11 0,-2.44; 12 0.5,-2.44; 13 1,-2.44; 14 1.5,-2.44; 22 1.5,2.44; 23 1,2.44; 24 0.5,2.44; 25 0,2.44; 26 -0.5,2.44; 27 -1,2.44; 28 -1.5,2.44 | smd 3.175 x 3.175: 29 0,0
TQFP32-08 = smd 1.27 x 0.559: 1 -4.293,2.8; 2 -4.293,2; 3 -4.293,1.2; 4 -4.293,0.4; 5 -4.293,-0.4; 6 -4.293,-1.2; 7 -4.293,-2; 8 -4.293,-2.8; 17 4.293,-2.8; 18 4.293,-2; 19 4.293,-1.2; 20 4.293,-0.4; 21 4.293,0.4; 22 4.293,1.2; 23 4.293,2; 24 4.293,2.8 | smd 0.559 x 1.27: 9 -2.8,-4.293; 10 -2,-4.293; 11 -1.2,-4.293; 12 -0.4,-4.293; 13 0.4,-4.293; 14 1.2,-4.293; 15 2,-4.293; 16 2.8,-4.293; 25 2.8,4.293; 26 2,4.293; 27 1.2,4.293; 28 0.4,4.293; 29 -0.4,4.293; 30 -1.2,4.293; 31 -2,4.293; 32 -2.8,4.293
SOT23-5 = smd 0.55 x 1.2: 1 -0.95,-1.3; 2 0,-1.3; 3 0.95,-1.3; 4 0.95,1.3; 5 -0.95,1.3
RESONATOR-SMD-3.2X1.3 = smd 0.45 x 1.905: 1 -1.2,0; 2 0,0; 3 1.2,0

### Placement (x,y rotation side)
3V3  11.43,35.56 0 bottom
ADR  17.78,13.97 0 bottom
C1  45.72,21.59 270 top
C2  36.83,26.67 270 top
C3  40.64,21.59 0 top
C4  8.89,19.05 0 top
C5  15.24,16.51 180 top
C6  19.05,22.86 0 top
C7  30.48,23.5 0 top
C8  19.05,31.75 180 top
C9  34.42,31.75 0 top
C10  22.86,21.97 270 top
C11  19.05,20.95 180 top
C12  19.05,26.67 0 top
C14  34.92,13.97 270 top
D1  48.26,21.59 90 top
D2  7.62,33.02 180 top
D3  7.62,30.48 180 top
D4  7.62,35.56 180 top
D5  7.62,38.1 180 top
FD1  5.08,1.27 0 top
FD2  5.08,1.27 0 bottom
FD3  45.72,49.53 0 bottom
FD4  45.72,49.53 0 top
FRAME2  -11.43,-29.21 0 top  (outside the outline)
J1  30.48,1.27 180 top
J2  12.7,5.08 0 top
J3  46.99,33.02 180 top
J4  38.1,5.08 0 top
J5  25.4,15.24 180 bottom
J6  25.4,44.45 0 top
J7  1.27,18.29 270 top
J8  10.16,46.99 0 top
J9  44.45,12.7 270 top
J10  40.64,46.99 0 top
J11  20.32,1.27 0 top
JP1  33.02,11.43 0 bottom
JP6  20.7,8.51 180 top
JP7  48.26,2.54 0 top
JP8  2.54,48.26 0 top
JP9  2.54,2.54 0 top
JP10  48.26,48.26 0 top
LOGO1  21.59,36.83 0 bottom
R1  11.43,38.1 0 top
R2  20.32,10.16 0 top
R3  34.92,26.67 90 top
R4  32.38,13.97 90 top
R5  17.78,12.7 270 top
R6  31.75,8.89 90 top
R7  14.48,29.21 270 top
R8  34.29,8.89 90 top
R9  15.88,29.21 270 top
R10  19.05,24.77 180 top
R11  11.43,30.48 0 top
R12  11.43,33.02 0 top
R14  27.94,7.62 0 top
R15  11.43,35.56 0 top
R18  20.32,34.29 0 top
R19  30.48,34.29 180 top
R20  30.48,21.59 0 top
S1  12.7,12.7 0 top
SCK  11.43,33.02 0 bottom
STEP  11.43,30.48 0 bottom
U1  25.4,26.67 0 top
U2  25.4,15.24 180 top
U44  19.05,29.21 90 top
U$1  [3V30]  0.25,35.56 0 top
U$2  [3V37]  27.94,1.52 90 top
U$3  [GND8]  30.48,1.52 90 top
U$4  [STAT5]  0.25,33.02 0 top
U$5  [SCL5]  22.86,1.65 90 top
U$6  [SDA6]  25.4,1.65 90 top
U$7  [STEP4]  0.25,30.48 0 top
U$8  [VIN3]  0.25,38.1 0 top
U$9  [QWIIC_5.5MM]  7.37,3.17 90 top
U$10  [8#35V0]  36.2,28.32 90 top
U$11  [8#35V0]  50.93,12.7 0 bottom
U$12  [VIN1]  36.2,33.4 90 top
U$13  [STAT0]  8.89,33.02 0 bottom
U$14  [E#STOP2]  0.89,41.27 0 top
U$15  [I_SUPER2_C-()-03]  34.29,13.34 0 bottom
U$16  [I_SUPER2_C-()-03]  34.29,13.34 0 bottom
U$17  [3V31]  6.22,10.67 0 bottom
U$18  [DTR4]  6.35,18.29 0 bottom
U$19  [DEBUG0]  4.7,6.48 90 top
U$20  [BLK2]  3.17,5.59 0 top
U$21  [GND0]  6.48,8.13 0 bottom
U$22  [GND0]  6.48,5.59 0 bottom
U$23  [LIM_SW3]  42.29,41.15 0 top
U$24  [INT4]  20.32,1.65 90 top
U$25  [ADR0]  20.19,16.38 0 bottom
U$26  [3V35]  27.94,1.52 90 bottom
U$27  [RESET1]  9.53,8.89 0 top
U$28  [GRN1]  3.17,18.29 0 top
U$29  [QWIIC_5.5MM]  42.93,3.17 90 top
U$30  [INT4]  20.32,1.65 90 bottom
U$31  [GND6]  30.48,1.52 90 bottom
U$32  [A#2]  25.78,36.83 0 top
U$33  [SDA4]  25.4,1.65 90 bottom
U$34  [SCL3]  22.86,1.65 90 bottom
U$35  [RXI3]  5.71,13.21 0 bottom
U$36  [A#3]  30.73,36.83 0 top
U$37  [STEP2]  8.89,30.48 0 bottom
U$38  [VIN0]  8.89,38.1 0 bottom
U$40  [8#35V0]  44.45,6.35 0 top
U$41  [INT2]  18.41,6.48 0 top
U$42  [GND1]  36.83,7.75 90 top
U$43  [PWR0]  36.83,12.7 90 top
U$44  [GND0]  51.18,10.16 0 bottom
U$45  [3V31]  8.89,35.56 0 bottom
U$46  [B#4]  20.95,36.83 0 top
U$47  [B#5]  15.75,36.83 0 top
U$48  [TXO2]  6.6,15.75 0 bottom
U$49  28.7,36.83 0 bottom
U$53  [PWR1]  51.31,15.24 0 bottom
U$54  [A#2]  32.77,45.85 90 bottom
U$55  [A#3]  27.81,45.85 90 bottom
U$56  [QWIIC_STEP0]  43.18,40.64 0 bottom
U$57  [B#4]  17.91,46.1 90 bottom
U$58  [B#5]  22.86,46.23 90 bottom
VIN  11.43,38.1 0 bottom
Y1  35.56,17.78 90 top

### Tracks (layer width: path | path; a pad name or v marks a point on that pad's centre or on a via)
3.3V  (via drill 0.38)
  Top 0.203: U2.4 29.97,14.84 | U2.18 21.88,17.24 22.1,17.02 22.1,14.35 22.48,13.97 J5.2 | 29.95,14.86 29.97,14.84 | U1.15 29.52,23.5 C7.1 29.63,26.16 32.43,28.96 33.27,28.96 v34.04,29.72 | R10.2 5.33,24.77 2.29,27.81 v2.29,30.73 4.19,30.73 5.33,29.59 8.13,29.59 9.27,28.45 12.06,28.45 13.84,26.67 C12.1 18.2,27.39 17.75,27.84 U44.5 | v17.14,9.78 17.27,9.78 17.78,10.29 R5.2 | R14.2 v29.97,7.62 | U2.6 31.44,16.44 31.75,16.13 31.75,14.84 | J7.4 5.97,10.67 7.62,12.32 v7.62,17.65 | 29.97,14.84 31.75,14.84 | 31.75,14.84 32.37,14.84 R4.2 C14.1 36.41,14.82 v36.96,15.37
  Top 0.254: v37.6,3.82 v37.59,3.81
  Top 0.305: JP6.2 v19.05,8.51
  Top 0.559: J2.2 v12.2,3.82 v12.19,3.81 | J4.2 v37.6,3.82
  VCC 0.203: v36.96,15.37 38.35,16.76 38.35,27.69 36.32,29.72 v34.04,29.72
  GND 0.203: v7.62,17.65 2.29,22.99 v2.29,30.73
  Bottom 0.203: 3V3.2 4.19,35.56 2.29,33.66 v2.29,30.73 | JP1.2 v33.02,10.03
  pour VCC (isolate 0.305): 0,20.07 50.8,20.07 50.8,0 0,0
!ENABLE!  (via drill 0.38)
  Top 0.203: U1.2 22.08,27.67 21.59,27.18 21.59,26.8 20.57,25.78 19.94,25.78 19.9,25.74 | R10.1 19.9,25.74 | U2.14 24.2,20.42 23.96,20.66 23.96,21.59 23.6,21.95 22.08,21.95 21.36,21.24 21.36,20.59 20.45,19.68 15.49,19.68 14.1,18.29 v13.2,18.29 | v4.33,29.3 7.89,25.74 19.9,25.74
  GND 0.203: v13.2,18.29 6.1,25.39 6.1,27.53 v4.33,29.3
!RST!  (via drill 0.38)
  Top 0.203: v16.89,10.79 S1.4 S1.3 9.02,10.79 8.51,11.3 8.51,16.76 9.74,18 C4.2 | J5.5 26.67,15.24 26.67,13.08 25.78,12.19 25.78,10.97 U2.29 25.8,8.27 v25.78,8.26 26.42,7.62 R14.1
  Bottom 0.203: v16.89,10.79 17.78,10.79 20.32,8.26 v25.78,8.26
!SLEEP!  (via drill 0.38)
  Top 0.203: U1.14 26.9,23.27 27.56,22.61 31.88,22.61 32.51,21.97 v32.51,18.92 | v33.82,14.1 33.82,13.6 33.34,13.12 R4.1 32.38,13.24 U2.2
  Bottom 0.203: v32.51,18.92 33.78,17.65 33.78,14.14 v33.82,14.1
A49885_!RESET!  (via drill 0.38)
  Top 0.203: R5.1 17.78,13.59 18.67,13.59 19.02,13.24 | U2.23 19.02,13.24 | U1.12 25.9,22.96 28.29,20.57 29.46,20.57 31.15,18.89 v31.48,18.89 | v19.05,12.7 19.02,12.73 19.02,13.24
  Bottom 0.203: v31.48,18.89 29.45,16.86 29.45,13.59 28.56,12.7 v19.05,12.7
AMP_CUR_SENSE  (via drill 0.38)
  Top 0.203: U2.19 20.14,16.44 19.68,16.89 17.27,16.89 16.51,17.65 v16.51,18.53 | R9.2 16.73,29.21 v16.89,29.21 18.8,29.21 19.75,28.26 U44.1
  GND 0.203: v16.89,29.21 15.75,28.07 15.75,19.29 v16.51,18.53
AREF
  Top 0.203: C5.1 19.53,16.51 20.41,15.63 21.09,15.63 U2.20
COILA+  (via drill 0.38)
  Top 0.305: U1.21 28.42,28.17 30.73,30.48 v30.73,34.67
  pour Bottom (isolate 0.305, no thermals): 30.1,46.35 34.8,46.35 34.8,36.83 32.59,34.16 30.1,34.16
  pour Top (isolate 0.305, no thermals): 30.23,35.18 31.37,35.18 31.37,30.35 28.83,28.07 27.43,28.07 30.23,30.73
COILA-
  Top 0.305: U1.24 25.9,31.12 25.78,31.24
  pour Top (isolate 0.305, rank 3, no thermals): 25.65,30.23 25.65,46.35 29.97,46.35 29.97,36.83 26.25,30.23
COILB+  (via drill 0.38)
  Top 0.305: U1.1 22.76,28.17 v21.84,29.08
  pour Bottom (isolate 0.305, no thermals): 20.57,46.35 16,46.35 16,36.83 18.3,34.16 20.57,34.16
  pour Top (isolate 0.305, no thermals): 23.37,28.07 21.46,28.07 21.46,29.46 22.1,29.46
  pour Bottom (isolate 0.305): 22.35,29.34 22.35,28.83 21.08,28.83 18.29,34.16 18.29,34.92 20.32,34.92 20.45,31.75
COILB-
  Top 0.305: U1.26 24.9,30.98
  pour Top (isolate 0.305, rank 3, no thermals): 25.15,30.23 25.15,46.35 20.83,46.35 20.83,36.83 24.43,30.23
CUR_REF
  Top 0.203: C2.1 R3.2 34.92,30.06 34.51,30.48 32.64,30.48 28.33,26.17 U1.17
CUR_REF_PWM
  Top 0.203: R3.1 34.92,21.72 33.53,20.32 33.53,18.93 32.64,18.04 31.26,18.04 30.7,18.6 29.52,18.6 28.58,19.53 U2.9
CURRENT_SENSE
  Top 0.203: U44.3 21.35,31.16 21.35,31.18 22.39,32.22
  Top 0.305: U1.27 24.4,30.21 22.52,32.09 | 22.52,32.09 22.39,32.22 | 22.52,32.09 R18.2
  pour Top (isolate 0.305, rank 2, no thermals): 24.37,30.23 23.92,30.23 21.08,33.63 21.08,36.2 24,36.2 24,31.26
DIR  (via drill 0.38)
  Top 0.203: U1.19 28.57,27.17 32.26,30.86 v36.45,30.86 | U2.10 27.4,18.07 v27.43,18.03
  VCC 0.203: v27.43,18.03 36.96,18.03 v37.47,18.54
  GND 0.203: v36.45,30.86 37.47,29.84 v37.47,18.54
DTR
  Top 0.203: J7.1 2.54,17.02 5.5,17.02 7.53,19.05 C4.1
GND  (via drill 0.38)
  Top 0.203: U1.18 26.67,26.67 | U1.3 23.76,27.17 v24.26,26.67 | U44.2 19.68,29.21 19.05,29.84 v19.05,30.1
  Top 0.559: v34.29,34.29 R19.1 | R18.1 v16.51,34.29
  other vias: 30.99,15.75 30.99,14.1 25.4,26.67 24.26,27.81 26.54,27.81 24.26,25.53 26.54,25.53 19.18,15.37 25.4,25.53 26.54,26.67 25.4,27.81 14.35,35.05 16.89,31.62 45.72,19.05 46.99,40.64 5.46,30.73 5.46,33.02 5.59,34.8 5.46,38.1 12.7,16.51 10.16,3.81 35.56,3.81 36.07,13.59 19.05,27.94 12.7,29.21 36.45,32.26 30.73,20.45 21.21,19.18 34.04,28.7 32.77,23.5 36.07,21.59 11.18,40.26 38.35,38.73
  pour Bottom (isolate 0.305, rank 3): 0,0 0,50.8 50.8,50.8 50.8,0
  pour Top (isolate 0.305, rank 4): 50.8,0 0,0 0,50.8 50.8,50.8
  pour GND (isolate 0.305): 0,50.8 50.8,50.8 50.8,0 0,0
INT  (via drill 0.38)
  Top 0.203: U2.24 21.17,12.38 21.17,11.28 20.83,10.94 20.25,10.94 R2.1 18.54,10.16 17.78,9.4 v17.78,4.43
  Bottom 0.203: v17.78,4.43 17.78,3.81 J11.1
INT0  (via drill 0.38)
  Top 0.203: U2.32 28.2,9.02 28.07,8.89 v28.08,8.89 | v6.22,40.13 8.89,40.13 9.16,40.4 J8.1
  VCC 0.203: v28.08,8.89 27.94,8.75 27.94,8.13 26.54,6.73 12.32,6.73 2.54,16.51 2.54,29.06 2.53,29.07 2.53,29.61 2.93,30.01 2.93,36.84 v6.22,40.13
INT1  (via drill 0.38)
  Top 0.203: U2.1 30.58,12.44 30.84,12.19 37.97,12.19 39.12,13.34 v39.12,14.22 | v39.12,40.39 39.64,40.91 J10.1
  GND 0.203: v39.12,40.39 v39.12,14.22
MISO
  Top 0.203: U2.16 22.66,19.47 22.66,18.84 23.5,18 23.5,17.14 J5.1
MOSI
  Top 0.203: J5.4 24.13,15.24 24.13,17.94 23.4,18.67 U2.15
MS1
  Top 0.203: U1.9 24.4,20.81 25.02,20.19 25.02,19.55
  Top 0.254: 25.02,19.55 U2.13
MS2
  Top 0.203: U1.10 24.9,20.95 25.8,20.05 U2.12
MS3
  Top 0.203: U2.11 26.6,20.14 25.4,21.34 U1.11
N$1
  Top 0.203: D3.A R11.1
N$2
  Top 0.203: U44.4 15.97,30.16 R9.1 R7.1
N$3
  Top 0.305: U1.23 26.4,30.08 28.32,32 28.32,34.25 R19.2
  pour Top (isolate 0.305, no thermals): 26.92,36.2 29.59,36.2 29.59,32.75 26.8,30.23 26.29,30.23 26.92,32.13
N$4  (via drill 0.38)
  Top 0.203: R1.2 v13.46,38.1
  Bottom 0.203: VIN.1 v13.46,38.1
N$5
  Top 0.203: JP6.1 21.21,10.12 R2.2
N$6  (via drill 0.38)
  Top 0.203: U2.22 19.88,14.04 v19.81,13.97
  Bottom 0.203: ADR.1 v19.81,13.97
N$7
  Top 0.559: J9.P$1 46.95,15.2 48.26,16.51 D1.A 49.28,19.44 50.04,20.19 50.04,25.4 48.12,27.32 J3.VIN0
N$8
  Top 0.203: U1.4 22.89,26.6 22.03,26.6 20.83,25.4 20.83,24.03 20.54,23.75 18.92,23.75 18.2,23.03 C6.1
N$9
  Top 0.203: U1.5 22.89,26.1 22.07,26.1 21.21,25.24 21.21,23.88 20.19,22.86 C6.2
N$10
  Top 0.203: R1.1 D5.A
N$11  (via drill 0.38)
  Top 0.203: R11.2 12.79,30.99 v13.46,30.99
  Bottom 0.203: STEP.1 12.95,30.48 v13.46,30.99
N$12
  Top 0.203: D2.A R12.1
N$13
  Top 0.203: U2.7 31.47,17.24 32.13,16.58 Y1.1
N$14
  Top 0.203: U2.8 30.6,18.04 31.02,17.62 32.99,17.62 34.35,18.98 Y1.3
N$15  (via drill 0.38)
  Top 0.203: R6.2 31.75,10.16 v31,10.91
  Bottom 0.203: v31,10.91 31.52,11.43 JP1.3
N$16  (via drill 0.38)
  Top 0.203: R8.2 34.29,10.03 v35.05,10.79
  Bottom 0.203: JP1.1 34.42,11.43 v35.05,10.79
N$17  (via drill 0.38)
  Top 0.203: R12.2 12.92,33.66 v12.92,34.16
  Bottom 0.203: SCK.1 12.83,33.02 13.08,33.27 13.08,34.01 v12.92,34.16
N$19
  Top 0.203: U1.13 26.4,23.13 27.94,21.59 R20.1
N$20
  Top 0.203: U1.8 23.9,23.01 23.71,22.82 C10.1
N$21
  Top 0.203: U1.6 22.24,25.67 21.59,25.02 21.59,22.73 19.9,21.04 C11.1
N$26
  Top 0.203: D4.A R15.1
N$27  (via drill 0.38)
  Top 0.203: R15.2 v13.46,35.56
  Bottom 0.203: 3V3.1 v13.46,35.56
RXI  (via drill 0.38)
  Top 0.203: v26.7,8.92 26.6,9.03 U2.30 | J7.3 v3.94,13.21
  Bottom 0.203: v26.7,8.92 26.7,8.16 26.15,7.61 19.04,7.61 18.52,8.13 11.46,8.13 6.38,13.21 v3.94,13.21
SCK  (via drill 0.38)
  Top 0.203: v25.41,17.78 25.41,16.52 J5.3 | v17.78,17.78 18.04,18.04 U2.17 22.33,18.04 v22.59,17.78
  GND 0.203: v17.78,17.78 16.26,17.78 15.24,18.8 15.24,26.54 14.22,27.56 14.22,31.24 13.59,31.88 v13.21,31.88
  Bottom 0.203: v25.41,17.78 v22.59,17.78 | SCK.2 10.92,32.38 11.43,31.88 v13.21,31.88
SCL  (via drill 0.38)
  Top 0.203: U2.28 25,5.7 | J2.4 14.2,4.34 14.99,3.56 22.86,3.56 | J4.4 39.6,5.99 39.12,6.48 34.29,6.48 | 34.29,6.48 v29.59,6.48 | R8.1 34.29,6.48 | 25,5.7 27.29,5.7 v28.07,6.48 | 22.86,3.56 25,5.7 | J1.4 22.86,3.56
  Bottom 0.203: v29.59,6.48 v28.07,6.48
SDA  (via drill 0.38)
  Top 0.203: v25.4,4.95 J1.3 25.4,1.4 v24,2.79 | J2.3 13.2,3.94 14.35,2.79 v21.59,2.79 | U2.27 24.2,6.03 v24.24,5.98 | v37.47,2.79 38.61,2.79 | 38.61,2.79 39.24,2.79 40.64,4.19 40.64,6.48 38.25,8.87 32.58,8.87 R6.1 | J4.3 38.6,2.8 38.61,2.79
  Bottom 0.203: J1.3 26.92,2.79 v37.47,2.79 | v21.59,2.79 v24,2.79 | v25.4,4.95 24.37,5.98 v24.24,5.98
STEP  (via drill 0.38)
  Top 0.203: U2.26 23.4,8.92 v23.37,8.89 v23.37,8.9 | v32.89,29.72 32.51,29.72 28.46,25.67 U1.16 | v11.05,17.53 13.97,17.53 15.74,19.3 18.42,19.3 v18.94,18.78
  GND 0.203: v3.17,29.34 3.17,25.4 v11.05,17.53 | v18.94,18.78 19.19,18.53 25.74,18.53 32.89,25.68 v32.89,29.72
  Bottom 0.203: v23.37,8.9 20.56,8.9 17.78,11.68 15.11,11.68 11.05,15.75 v11.05,17.53 | STEP.2 10.41,29.97 3.81,29.97 v3.17,29.34
TXO  (via drill 0.38)
  Top 0.203: v27.43,9.65 27.43,10.91 U2.31 | J7.2 3.81,15.75 4.58,14.97 4.58,12.31 v4.95,11.94
  Bottom 0.203: v27.43,9.65 27.43,8.26 26.4,7.23 18.88,7.23 18.36,7.75 11.3,7.75 7.11,11.94 v4.95,11.94
VIN  (via drill 0.38, 0.58)
  Top 0.203: C11.2 3.81,20.95 1.52,23.24 1.52,34.16 4.32,36.96 v9.53,36.96
  Top 0.305: U1.28 23.29,29.72 v23.11,29.72 | U1.22 27.51,29.72 v27.69,29.72
  Top 0.559: D1.C 46.96,22.44 C1.1 43.89,22.44 C3.+ 43.04,29.32 v43.05,29.34 | v32.26,31.75 C9.1 33.57,31.92 | C8.1 20.83,31.75 v21.22,32.15
  Bottom 0.559: VIN.2 9.78,36.96 v9.53,36.96
  pour VCC (isolate 0.305): 0,50.8 50.8,50.8 50.8,20.7 0,20.7
  pour Top (isolate 0.305, no thermals): 26.8,28.57 26.8,29.59 27.43,30.23 28.19,30.23 28.19,29.39
  pour Top (isolate 0.305, no thermals): 24,28.7 24,29.72 23.39,30.23 22.61,30.23 22.61,29.59 22.99,29.08

### Text on the board
tValues: Brian Schmalz: http://schmalzhaus.com/BigEasyDriver/index.html